# EAGLE design Component to DVI-A Compact (EAGLE 7.1.0)
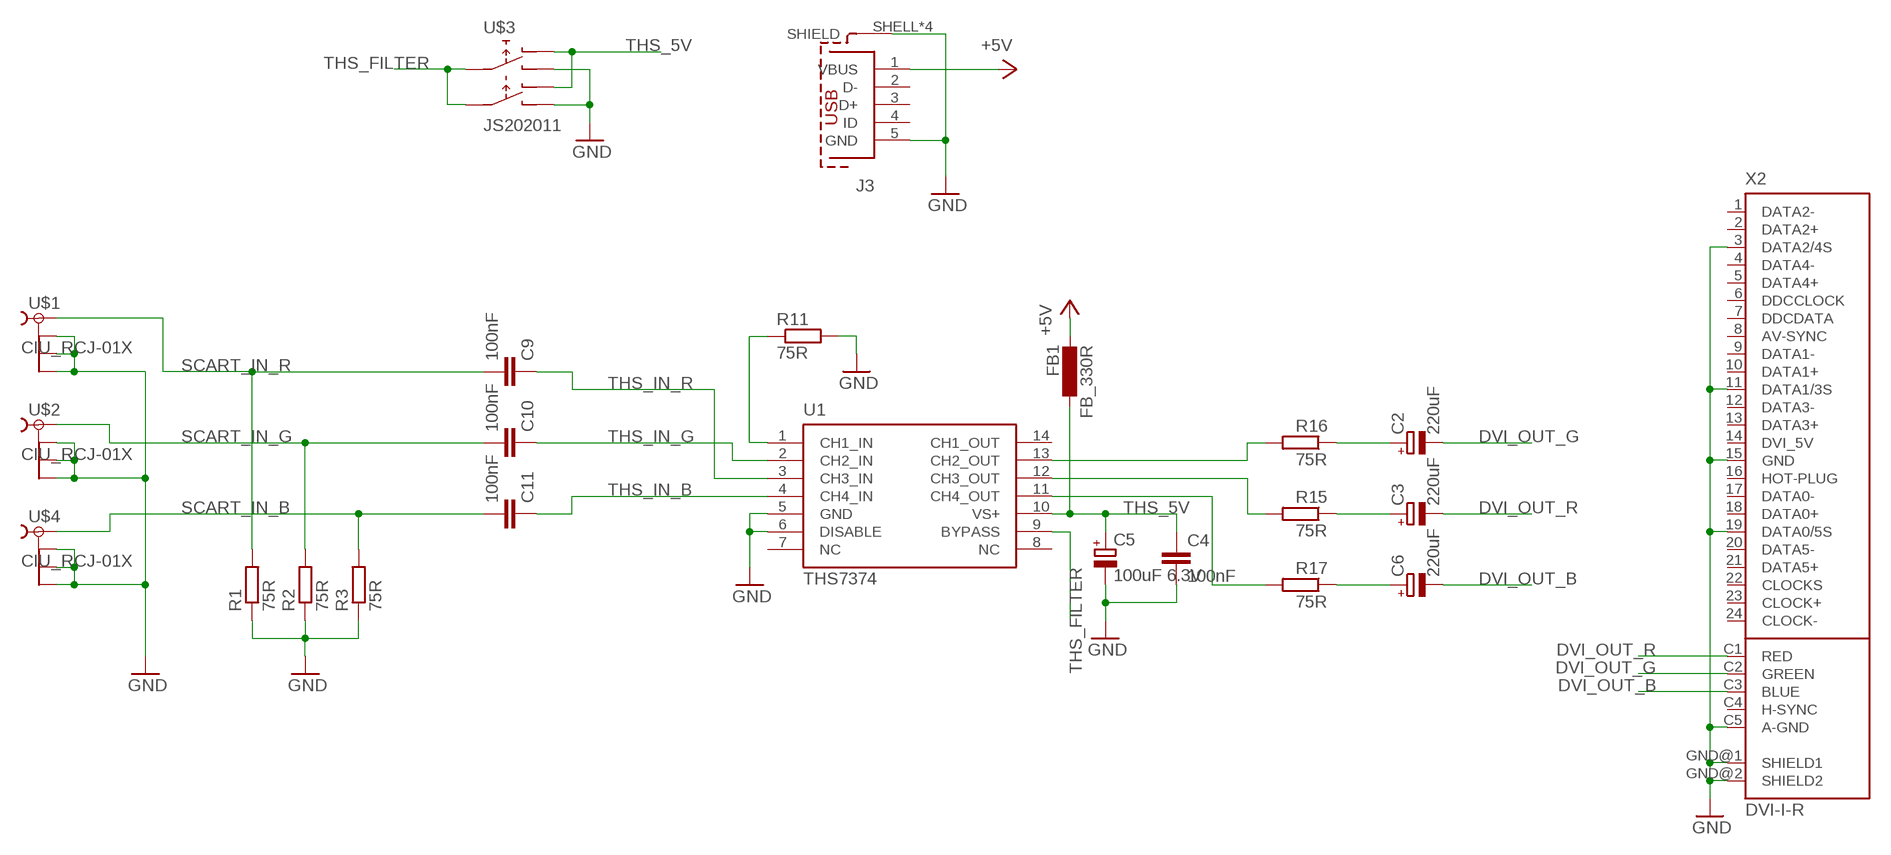
[diagram p0: schematic, sheet 1]

## Parts
C2  220uF  CPOL-EUSMCC  [SMC_C]
C3  220uF  CPOL-EUSMCC  [SMC_C]
C4  100nF  C-EUC0603  [C0603]
C5  100uF 6.3V  CPOL-EUB  [PANASONIC_B]
C6  220uF  CPOL-EUSMCC  [SMC_C]
C9  100nF  C-EUC0603  [C0603]
C10  100nF  C-EUC0603  [C0603]
C11  100nF  C-EUC0603  [C0603]
FB1  FB_330R  L-EUL2012C  [L2012C]
J3  629105150521  [629105150521]
R1  75R  R-EU_R0603  [R0603]
R2  75R  R-EU_R0603  [R0603]
R3  75R  R-EU_R0603  [R0603]
R11  75R  R-EU_R0603  [R0603]
R15  75R  R-EU_R0603  [R0603]
R16  75R  R-EU_R0603  [R0603]
R17  75R  R-EU_R0603  [R0603]
U1  THS7374  [SO14W]
U$1  CIU_RCJ-01X  [CIU_RCJ-01X]
U$2  CIU_RCJ-01X  [CIU_RCJ-01X]
U$3  JS202011  [JS202011]
U$4  CIU_RCJ-01X  [CIU_RCJ-01X]
X2  DVI-I-R  [DVI-I-R]

## Nets
+5V: FB1.2 J3.1(VBUS)
CH1_OUT: R15.2 U1.12(CH3_OUT)
CH2_OUT: R16.2 U1.13(CH2_OUT)
CH3_OUT: R17.2 U1.11(CH4_OUT)
DVI_OUT_B: C6.- X2.C3(BLUE)
DVI_OUT_G: C2.- X2.C2(GREEN)
DVI_OUT_R: C3.- X2.C1(RED)
GND: C4.2 C5.- J3.5(GND) J3.SHELL1(SHIELD) J3.SHELL2(SHIELD) J3.SHELL3(SHIELD) J3.SHELL(SHIELD) R1.1 R2.1 R3.1 R11.2 U1.5(GND) U1.6(DISABLE) U$1.2@1 U$1.2@2 U$1.2@3 U$2.2@1 U$2.2@2 U$2.2@3 U$3.1 U$3.4 U$4.2@1 U$4.2@2 U$4.2@3 X2.3(DATA2/4S) X2.11(DATA1/3S) X2.15(GND) X2.19(DATA0/5S) X2.C5(A-GND) X2.GND@1(SHIELD1) X2.GND@2(SHIELD2)
N$1: C6.+ R17.1
N$2: C3.+ R15.1
N$3: C2.+ R16.1
N$4: R11.1 U1.1(CH1_IN)
SCART_IN_B: C11.2 R3.2 U$4.1
SCART_IN_G: C10.2 R2.2 U$2.1
SCART_IN_R: C9.2 R1.2 U$1.1
THS_5V: C4.1 C5.+ FB1.1 U1.10(VS+) U$3.3 U$3.6
THS_FILTER: U1.9(BYPASS) U$3.2 U$3.5
THS_IN_B: C11.1 U1.4(CH4_IN)
THS_IN_G: C10.1 U1.2(CH2_IN)
THS_IN_R: C9.1 U1.3(CH3_IN)
Unconnected: J3.2(D-) J3.3(D+) J3.4(ID) U1.7(NC) U1.8(NC) U1.14(CH1_OUT) X2.1(DATA2-) X2.2(DATA2+) X2.4(DATA4-) X2.5(DATA4+) X2.6(DDCCLOCK) X2.7(DDCDATA) X2.8(AV-SYNC) X2.9(DATA1-) X2.10(DATA1+) X2.12(DATA3-) X2.13(DATA3+) X2.16(HOT-PLUG) X2.17(DATA0-) X2.18(DATA0+) X2.20(DATA5-) X2.21(DATA5+) X2.22(CLOCKS) X2.23(CLOCK+) X2.24(CLOCK-) X2.C4(H-SYNC)

## Power pins joined to a net without a drawn wire
AGND: X2.C6(AGND)
DVI_5V: X2.14(DVI_5V)

## Library data of the parts
C2 C3 C5 C6 = rcl:CPOL-EU: POLARIZED CAPACITOR, European symbol
C4 C9-C11 = rcl:C-EU: CAPACITOR, European symbol
FB1 = rcl:L-EU: INDUCTOR, European symbol
J3 = con-wurth:629105150521: WR-COM_USB_Micro Type B_Horizontal_SMT ; Micro Type B Horizontal SMT - 3A current at Pin1 & Pin 5 - with Pegs and THT shielding Pins - T&R Packaging Code : Con_I-O_COM_USB_2.0_B_629105150521_629105150521 <http://katalog.we-online.de/media/images/eican/Con_I-O_COM_USB_2.0_B_629105150521_pf2.jpg> Details see: http://katalog.we-online.de/em/datasheet/629105150521.pdf Created 12/08/2014, Dan Xu 2014 (C) Wurth Elektronik
R1-R3 R11 R15-R17 = rcl:R-EU_: RESISTOR, European symbol
U1 = texas:THS7374
U$1 U$2 U$4 = con-hirschmann:CIU_RCJ-01X
U$3 = switch:JS202011
X2 = con-molex:DVI-I-R: CONNECTOR MiroCross(TM)-DVI i/0 plug and receptacle connector system (scart); OC_FARNELL: unknown; OC_NEWARK: unknown

## Board
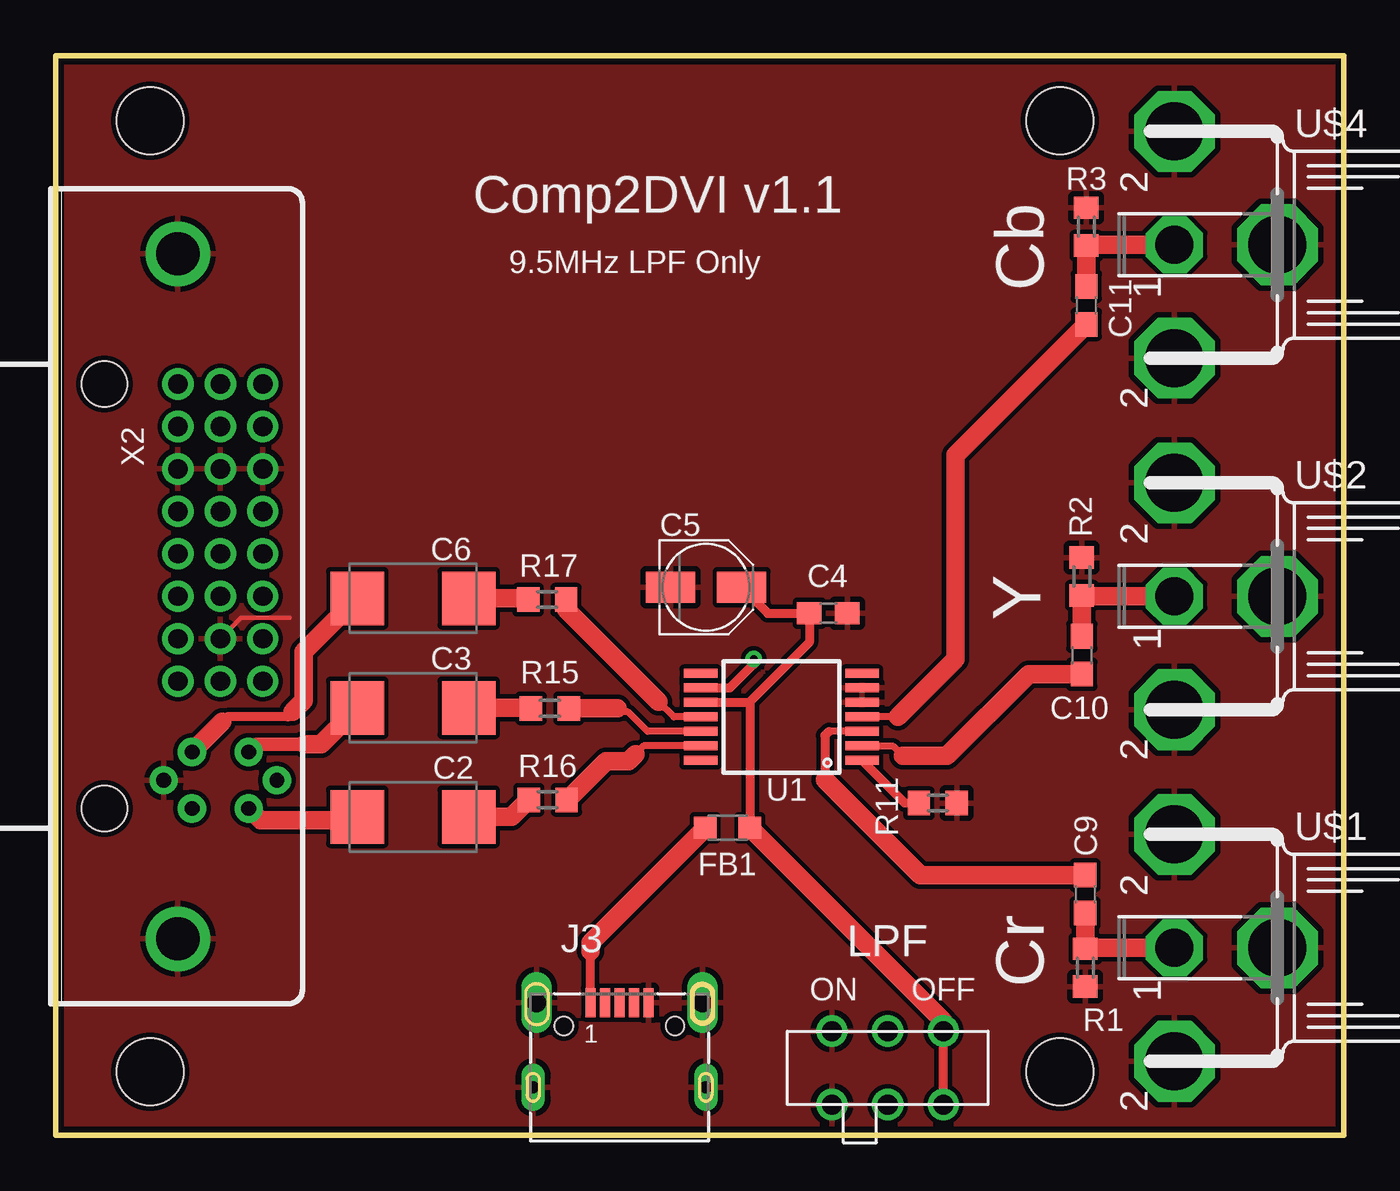
[diagram p1: board, top side]
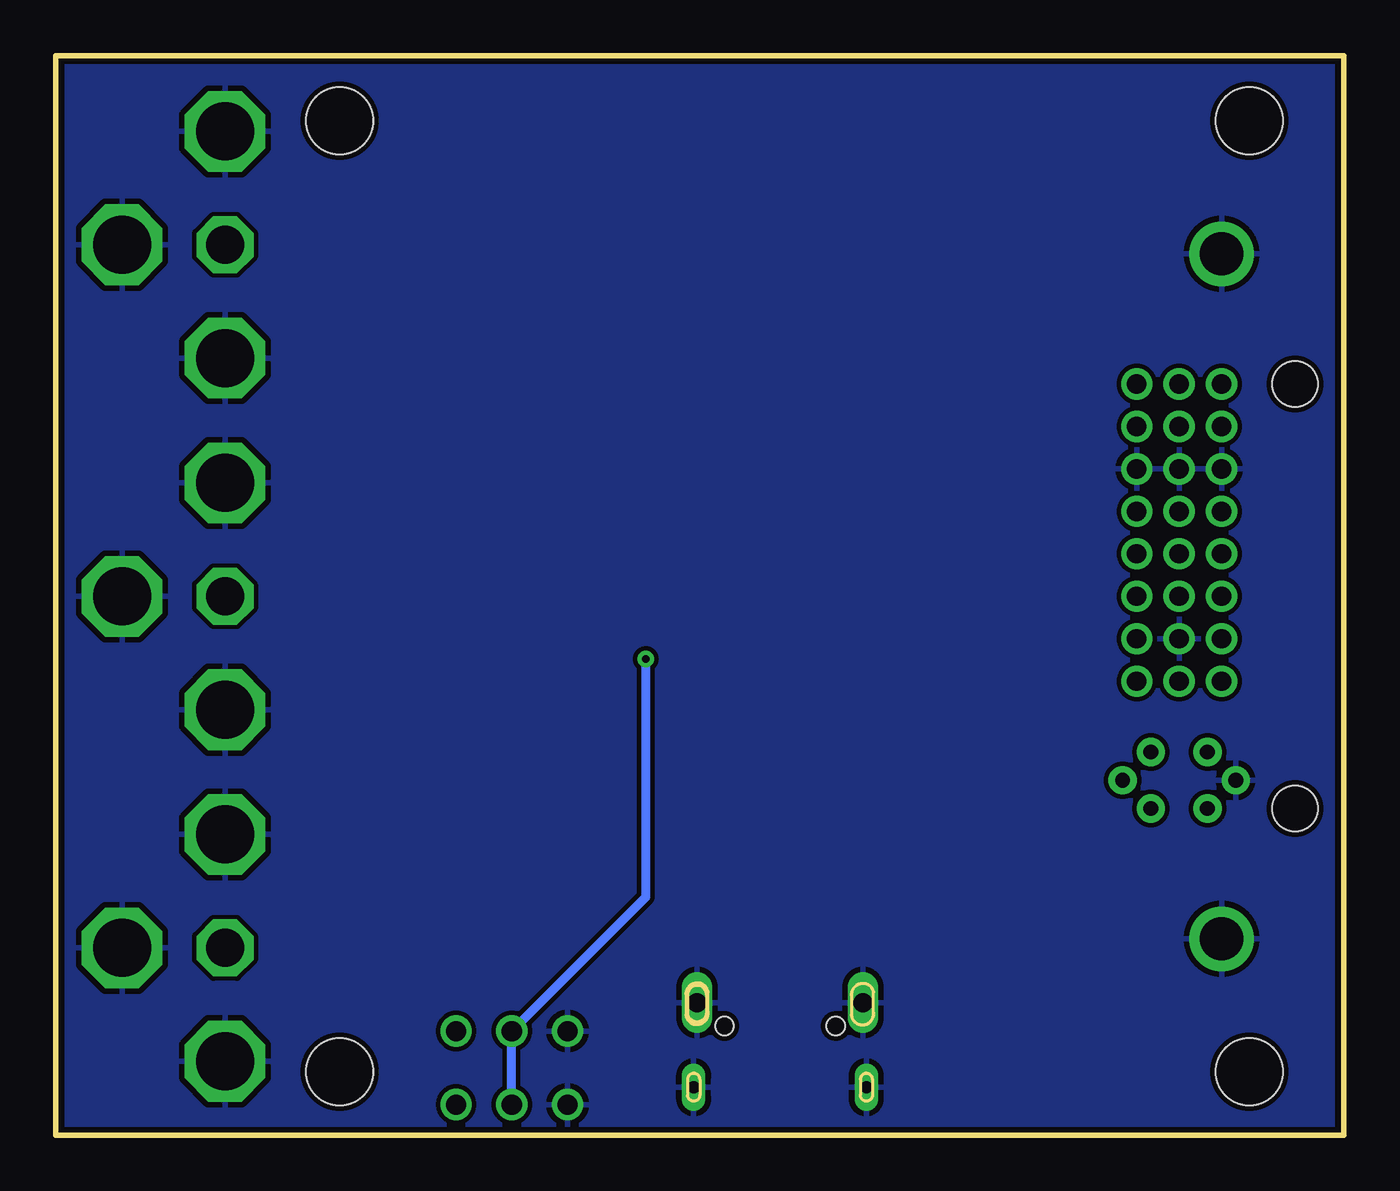
[diagram p2: board, bottom side, seen from below]

Size 57.82 x 48.44 mm. Coordinates in mm from the lower left corner, seen from the top.
Outline: 0,0 0,48.44 57.82,48.44 57.82,0 0,0
Copper layers (1*16): Top 0.035mm / dielectric 1.5mm / Bottom 0.035mm
Design rules "default *": minimum track width 10mil, minimum drill 24mil, track to track 8mil, track to pad 8mil, pad to pad 8mil, via to via 8mil, smd to smd 8mil, copper to edge 10mil, drill to drill 8mil, minimum pad ring 10mil, minimum via ring 8mil, stop-mask expansion 4mil, vias tented up to drill 0mil, thermal gap 10mil
Holes 3 mm at 4.24,2.84 45.07,45.52 4.24,45.52 45.07,2.84

### Footprints (pad centres in the part's own frame; a part is rotated, then mirrored left to right if it is on the bottom)
SMC_C = smd 2.4 x 2.4: + -2.5,0; - 2.5,0
C0603 = smd 1.1 x 1: 1 -0.85,0; 2 0.85,0
PANASONIC_B = smd 2.2 x 1.4: + 1.6,0; - -1.6,0
L2012C = smd 1 x 1: 1 -1,0; 2 1,0
629105150521 = smd 0.45 x 1.3: 1 -1.3,1.05; 2 -0.65,1.05; 3 0,1.05; 4 0.65,1.05; 5 1.3,1.05 | drill 0.85 pad 1.2 long: SHELL -3.725,1.05; SHELL1 3.725,1.05 | drill 0.55 pad 0.9 long: SHELL2 -3.875,-2.75; SHELL3 3.875,-2.75 | hole 0.8: -2.5,0; 2.5,0
R0603 = smd 1 x 1.1: 1 -0.85,0; 2 0.85,0
SO14W = smd 0.4 x 1.5: 1 -1.95,-3.625; 2 -1.3,-3.625; 3 -0.65,-3.625; 4 0,-3.625; 5 0.65,-3.625; 6 1.3,-3.625; 7 1.95,-3.625; 8 1.95,3.625; 9 1.3,3.625; 10 0.65,3.625; 11 0,3.625; 12 -0.65,3.625; 13 -1.3,3.625; 14 -1.95,3.625
CIU_RCJ-01X = drill 1.7 octagon: 1 0,-4.58 | drill 2.6 octagon: 2@1 -5.088,-4.58; 2@2 0,0.04; 2@3 5.088,-4.58
JS202011 = drill 0.9: 1 -2.5,-1.7; 2 0,-1.7; 3 2.5,-1.7; 4 -2.5,1.6; 5 0,1.6; 6 2.5,1.6
DVI-I-R = drill 0.864 pad 1.397: 1 -9.525,6.985; 2 -7.62,6.985; 3 -5.715,6.985; 4 -3.81,6.985; 5 -1.905,6.985; 6 0,6.985; 7 1.905,6.985; 8 3.81,6.985; 9 -9.525,5.08; 10 -7.62,5.08; 11 -5.715,5.08; 12 -3.81,5.08; 13 -1.905,5.08; 14 0,5.08; 15 1.905,5.08; 16 3.81,5.08; 17 -9.525,3.175; 18 -7.62,3.175; 19 -5.715,3.175; 20 -3.81,3.175; 21 -1.905,3.175; 22 0,3.175; 23 1.905,3.175; 24 3.81,3.175 | drill 0.66 pad 1.27: C1 6.985,6.35; C2 9.525,6.35; C3 6.985,3.81; C4 9.525,3.81; C5 8.255,2.54; C6 8.255,7.62 | drill 1.93: GND@1 -15.367,3.175; GND@2 15.367,3.175 | hole 2.032: -9.525,-0.127; 9.525,-0.127

### Placement (x,y rotation side)
C2  16.04,14.28 180 top
C3  16.04,19.18 180 top
C4  34.68,23.42 0 top
C5  29.19,24.59 0 top
C6  16.04,24.09 180 top
C9  46.21,10.82 270 top
C10  46.06,21.54 90 top
C11  46.26,37.24 90 top
FB1  30.16,13.79 180 top
J3  25.31,4.9 0 top
R1  46.21,7.52 90 top
R2  46.06,25.07 270 top
R3  46.26,40.77 270 top
R11  39.59,14.91 0 top
R15  22.18,19.15 0 top
R16  22.08,15.05 0 top
R17  22.06,24.04 0 top
U1  32.57,18.77 90 top
U$1  54.8,8.41 270 top
U$2  54.8,24.18 270 top
U$3  37.35,3.07 0 top
U$4  54.8,39.95 270 top
X2  2.31,24.18 270 top

### Tracks (layer width: path | path; a pad name or v marks a point on that pad's centre or on a via)
+5V
  Top 0.406: J3.1 24.01,8.25
  Top 0.838: 24.01,8.25 24.01,8.64 FB1.2
CH1_OUT
  Top 0.305: U1.12 26.56,18.12 25.69,19 25.31,19 25.23,19.15
  Top 0.838: 25.23,19.15 R15.2
CH2_OUT
  Top 0.305: U1.13 26.39,17.47 26.01,17.09
  Top 0.838: 26.01,17.09 25.71,16.79 24.7,16.79 22.96,15.05 R16.2
CH3_OUT
  Top 0.305: U1.11 27.74,18.77 27.06,19.46
  Top 0.838: 27.06,19.46 22.91,23.61 R17.2
DVI_OUT_B
  Top 0.406: 10.64,19 10.41,18.77 7.7,18.77 7.47,18.54
  Top 0.838: 7.47,18.54 X2.C3 | C6.- 11.14,21.69 11.14,19.49 10.64,19
DVI_OUT_G
  Top 0.838: X2.C2 9.19,14.12 13.38,14.12 C2.-
DVI_OUT_R
  Top 0.61: 11.18,17.55 9.02,17.55 X2.C1
  Top 0.838: C3.- 11.91,17.55 11.18,17.55
GND
  Top 0.203: 10.49,23.22 8.33,23.22 X2.15
  pour Top: 0,0 0,48.44 57.82,48.44 57.82,0
  pour Bottom: 0,0 0,48.44 57.82,48.44 57.82,0
N$1
  Top 0.838: R17.1 20.85,24.09 C6.+
N$2
  Top 0.838: R15.1 21.3,19.18 C3.+
N$3
  Top 0.838: C2.+ 20.46,14.28 R16.1
N$4
  Top 0.406: R11.1 38.11,14.91 U1.1
SCART_IN_B
  Top 0.838: C11.2 R3.2 46.26,39.95 U$4.1
SCART_IN_G
  Top 0.838: C10.2 R2.2 46.06,24.18 U$2.1
SCART_IN_R
  Top 0.838: U$1.1 46.21,8.41 R1.2 C9.2
THS_5V
  Top 0.406: U1.10 31.14,19.42 | U$3.3 U$3.6 | 31.14,19.42 33.83,22.11 C4.1 31.96,23.42 C5.+ | 31.14,19.42 arc-90 31.16,19.4 FB1.1
  Top 0.838: U$3.6 39.84,5.1 FB1.1
THS_FILTER  (via drill 0.33)
  Top 0.406: U1.9 30.26,20.07 31.33,21.13 v31.33,21.36
  Bottom 0.406: U$3.2 U$3.5 31.33,10.69 v31.33,21.36
THS_IN_B
  Top 0.305: 37.8,18.77 U1.4
  Top 0.838: 37.8,18.77 40.39,21.36 40.39,30.52 C11.1
THS_IN_G
  Top 0.254: U1.2
  Top 0.305: U1.2 37.58,17.47 38.03,17.02
  Top 0.838: 38.03,17.02 40.01,17.02 43.68,20.69 C10.1
THS_IN_R
  Top 0.305: U1.3 34.71,18.12
  Top 0.406: 34.53,15.95 34.53,17.93 34.71,18.12
  Top 0.838: 34.53,15.95 38.81,11.67 C9.1

### Text on the board
tPlace: Comp2DVI v1.1 | 9.5MHz LPF Only | Cb | Y | LPF | ON | OFF | Cr